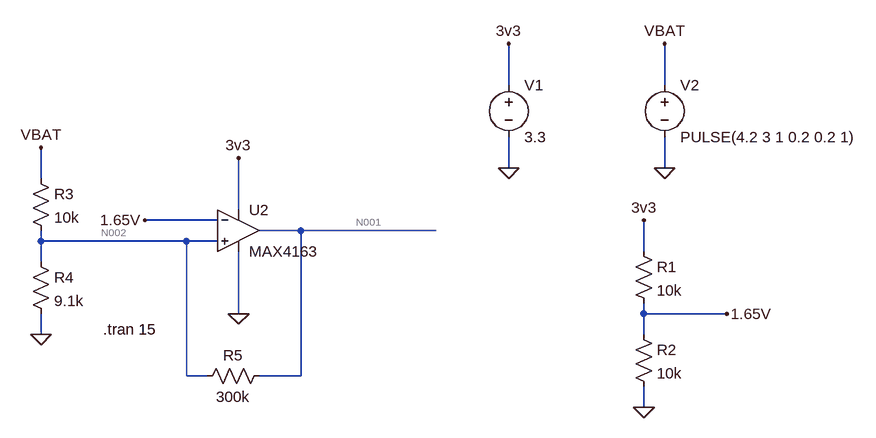
[diagram p0: schematic Draft2.asc]
Draft2.asc, the LTspice schematic file:
Version 4.1
SHEET 1 1260 680
WIRE 688 -80 688 -144
WIRE 928 -80 928 -144
WIRE 688 48 688 0
WIRE 928 48 928 0
WIRE -32 64 -32 16
WIRE 272 112 272 32
WIRE 240 128 128 128
WIRE 368 144 304 144
WIRE 576 144 368 144
WIRE -32 160 -32 144
WIRE 192 160 -32 160
WIRE 240 160 192 160
WIRE 896 176 896 128
WIRE -32 192 -32 160
WIRE 272 272 272 176
WIRE 896 272 896 256
WIRE 1024 272 896 272
WIRE -32 304 -32 272
WIRE 896 304 896 272
WIRE 192 368 192 160
WIRE 224 368 192 368
WIRE 368 368 368 144
WIRE 368 368 304 368
WIRE 896 416 896 384
FLAG 688 48 0
FLAG 688 -144 3v3
FLAG 272 32 3v3
FLAG 272 272 0
FLAG 928 48 0
FLAG 928 -144 VBAT
FLAG 896 416 0
FLAG 896 128 3v3
FLAG 1024 272 1.65V
FLAG 128 128 1.65V
FLAG -32 304 0
FLAG -32 16 VBAT
SYMBOL voltage 688 -96 R0
WINDOW 123 0 0 Left 0
WINDOW 39 0 0 Left 0
SYMATTR InstName V1
SYMATTR Value 3.3
SYMBOL voltage 928 -96 R0
WINDOW 123 0 0 Left 0
WINDOW 39 0 0 Left 0
SYMATTR InstName V2
SYMATTR Value PULSE(4.2 3 1 0.2 0.2 1)
SYMBOL res 880 160 R0
SYMATTR InstName R1
SYMATTR Value 10k
SYMBOL res 880 288 R0
SYMATTR InstName R2
SYMATTR Value 10k
SYMBOL res -48 48 R0
SYMATTR InstName R3
SYMATTR Value 10k
SYMBOL res -48 176 R0
SYMATTR InstName R4
SYMATTR Value 9.1k
SYMBOL res 320 352 R90
WINDOW 0 0 56 VBottom 2
WINDOW 3 32 56 VTop 2
SYMATTR InstName R5
SYMATTR Value 300k
SYMBOL OpAmps\\MAX4163 272 80 R0
SYMATTR InstName U2
TEXT 64 296 Left 2 !.tran 15

The netlist it stands for:
* Draft2.asc
V1 3v3 0 3.3
V2 VBAT 0 PULSE(4.2 3 1 0.2 0.2 1)
R1 3v3 1.65V 10k
R2 1.65V 0 10k
R3 VBAT N002 10k
R4 N002 0 9.1k
R5 N001 N002 300k
X§U2 N002 1.65V 3v3 0 N001 MAX4163  ; pins In+ In- V+ V- OUT
.tran 15
.backanno
.end

* Results of the author's LTspice run, read from the files saved beside the schematic
* Operating Point, zero values left out:
*   V(vbat) = 4.2 V
*   V(n002) = 2.021 V
*   V(n001) = 3.301 V
*   V(3v3) = 3.3 V
*   V(1.65v) = 1.65 V
*   I(V1) = -195.9 µA
*   I(R3) = 217.9 µA
*   I(R4) = 222.1 µA
*   I(R1) = 165 µA
*   I(R2) = 165 µA
*   I(R5) = 4.266 µA
*   I(V2) = -217.9 µA
*   Ix(u2:3) = 30.92 µA
*   Ix(u2:4) = -26.65 µA
*   Ix(u2:5) = -4.266 µA
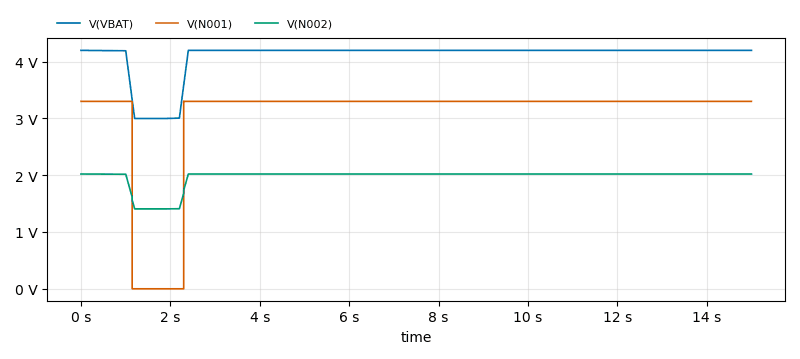
[diagram p1: Transient Analysis of Draft2.asc, plotted from the saved traces]
* Transient Analysis, 1 run:
*   V(VBAT): min 3 V, max 4.2 V, average 4.104 V, rms 4.116 V, last 4.2 V
*   V(N001): min -960.3 µV, max 3.301 V, average 3.047 V, rms 3.172 V, last 3.301 V
*   V(N002): min 1.407 V, max 2.021 V, average 1.972 V, rms 1.979 V, last 2.021 V